# Altium schematic sheet 8X8_MATRIX_LED.SchDoc
size A4; SheetNumber: 6; SheetTotal: 8
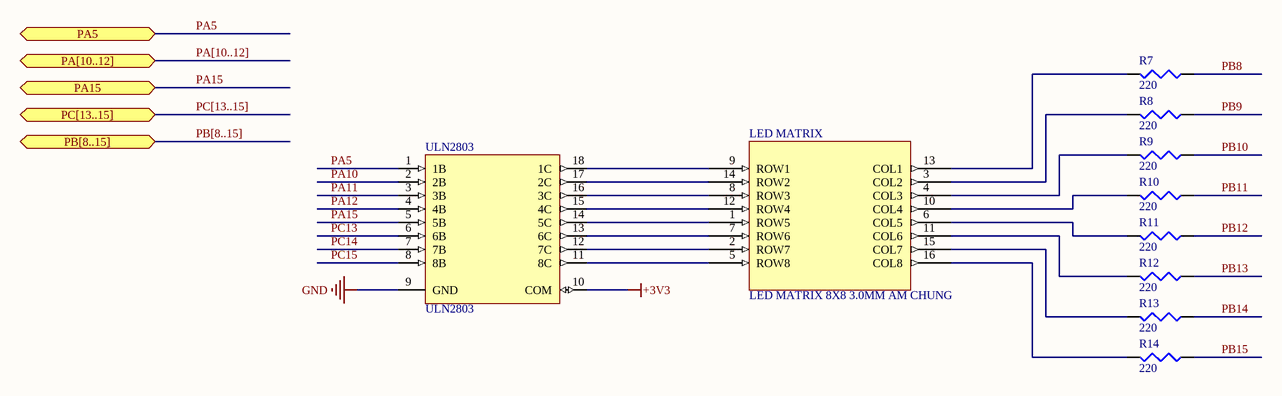
[diagram p0: 8X8_MATRIX_LED.SchDoc]

## Parts
LED_MATRIX  LED MATRIX 8X8 3.0MM AM CHUNG  [MATRIX LED 8X8 3.0mm]
R7  220  [0805 (2012 Metric)]
R8  220  [0805 (2012 Metric)]
R9  220  [0805 (2012 Metric)]
R10  220  [0805 (2012 Metric)]
R11  220  [0805 (2012 Metric)]
R12  220  [0805 (2012 Metric)]
R13  220  [0805 (2012 Metric)]
R14  220  [0805 (2012 Metric)]
ULN2803  ULN2803  [SOP18 - UMW]

## Ports
PA5 (bidir), PA15 (bidir), PA[10..12] (bidir), PB[8..15] (bidir), PC[13..15] (bidir)

## Nets
+3V3: ULN2803.10(COM)
GND: ULN2803.9(GND)
PA5: ULN2803.1(1B) ; port PA5
PA10: ULN2803.2(2B)
PA11: ULN2803.3(3B)
PA12: ULN2803.4(4B)
PA15: ULN2803.5(5B) ; port PA15
PB8: R7.1
PB9: R8.1
PB10: R9.1
PB11: R10.1
PB12: R11.1
PB13: R12.1
PB14: R13.1
PB15: R14.1
PC13: ULN2803.6(6B)
PC14: ULN2803.7(7B)
PC15: ULN2803.8(8B)
NetLED_MATRIX_1: LED_MATRIX.1(ROW5) ULN2803.14(5C)
NetLED_MATRIX_2: LED_MATRIX.2(ROW7) ULN2803.12(7C)
NetLED_MATRIX_3: LED_MATRIX.3(COL2) R8.2
NetLED_MATRIX_4: LED_MATRIX.4(COL3) R9.2
NetLED_MATRIX_5: LED_MATRIX.5(ROW8) ULN2803.11(8C)
NetLED_MATRIX_6: LED_MATRIX.6(COL5) R11.2
NetLED_MATRIX_7: LED_MATRIX.7(ROW6) ULN2803.13(6C)
NetLED_MATRIX_8: LED_MATRIX.8(ROW3) ULN2803.16(3C)
NetLED_MATRIX_9: LED_MATRIX.9(ROW1) ULN2803.18(1C)
NetLED_MATRIX_10: LED_MATRIX.10(COL4) R10.2
NetLED_MATRIX_11: LED_MATRIX.11(COL6) R12.2
NetLED_MATRIX_12: LED_MATRIX.12(ROW4) ULN2803.15(4C)
NetLED_MATRIX_13: LED_MATRIX.13(COL1) R7.2
NetLED_MATRIX_14: LED_MATRIX.14(ROW2) ULN2803.17(2C)
NetLED_MATRIX_15: LED_MATRIX.15(COL7) R13.2
NetLED_MATRIX_16: LED_MATRIX.16(COL8) R14.2

## Buses and harness runs
bus PA[10..12] = port PA[10..12]
bus PB[8..15] = port PB[8..15]
bus PC[13..15] = port PC[13..15]

## Library data of the parts
LED_MATRIX = CMP-007-000000-4: https://www.thegioiic.com/1088as-led-ma-tran-8x8-am-chung-mau-do-diem-dot-3-0mm; Source: LEDMATRIX8X8.SchLib; Design Item ID: D?; JLCPCB Part #: C2980922
R7-R14 = CMP-009-00179-13: Oreki; Value: 220; ComponentLink1Description: DigiKey; RoHS Compliant: Yes; Mounting Technology: SMT; Pins: 2; Case/Package: Chip
ULN2803 = CMP-014-00003-8: LLQT; ComponentLink3Description: DATASHEET UMW; ComponentLink1URL: https://datasheet.lcsc.com/lcsc/1810272108_Texas-Instruments-ULN2803ADWR_C9683.pdf; ComponentLink2URL: https://www.mouser.com/datasheet/2/408/ULN2803APG_datasheet_en_20121126-1224148.pdf; ComponentLink3URL: https://mm.digikey.com/Volume0/opasdata/d220001/medias/docus/5338/ULN2803.pdf; ComponentLink1Description: DATASHEET ADWR; ComponentLink2Description: DATASHEET APG; JLCPCB Part #: C5252904